# EAGLE design extruder_breakout_14 (EAGLE 6.5.0)
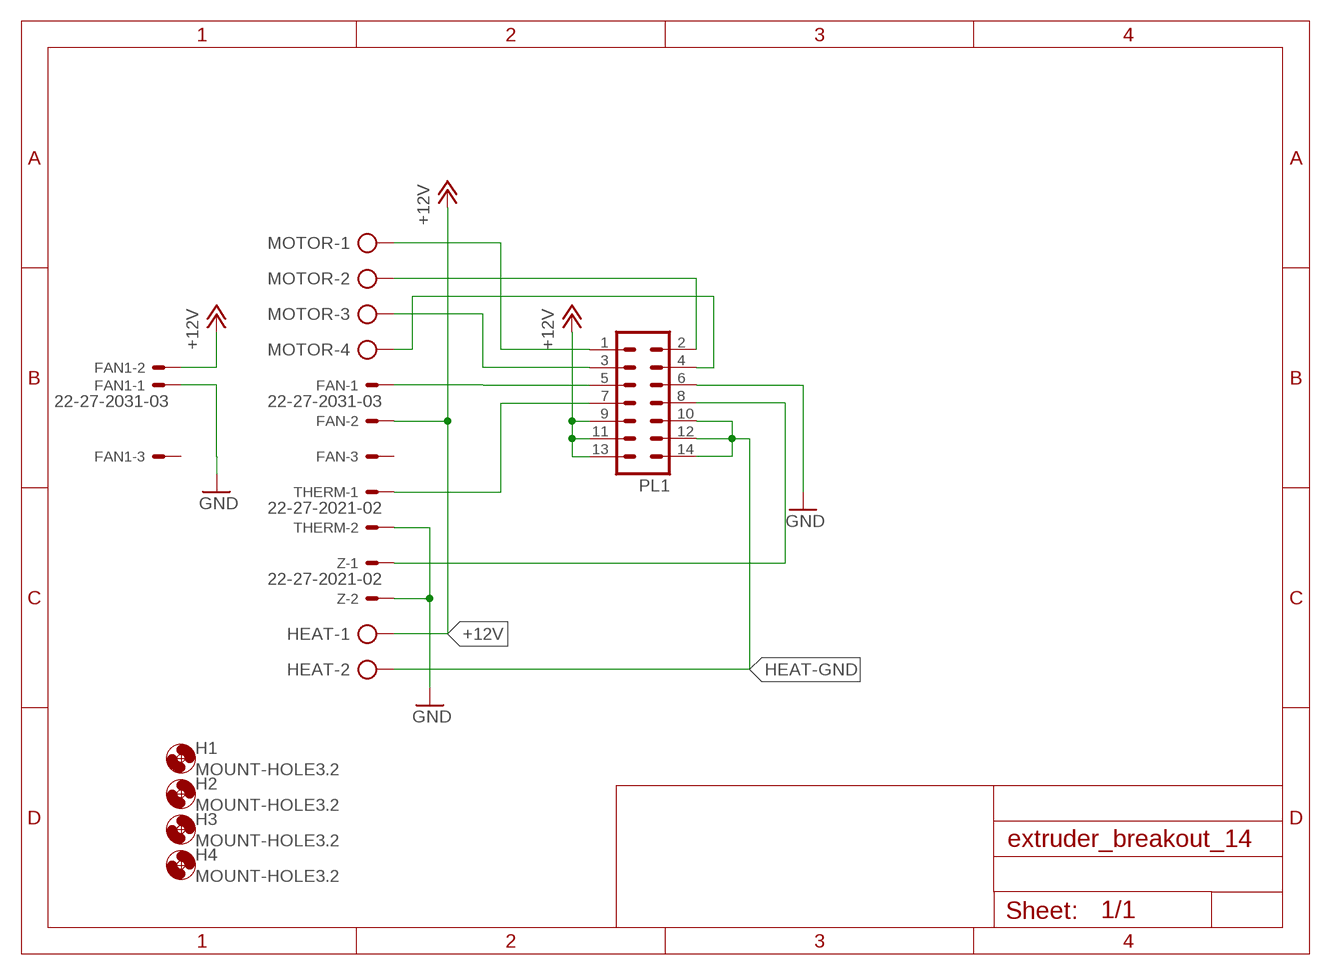
[diagram p0: schematic, sheet 1]

## Parts
FAN  22-27-2031-03  [6410-03]
FAN1  22-27-2031-03  [6410-03]
H1  MOUNT-HOLE3.2  [3,2]
H2  MOUNT-HOLE3.2  [3,2]
H3  MOUNT-HOLE3.2  [3,2]
H4  MOUNT-HOLE3.2  [3,2]
HEAT  AK500/2  [AK500/2]
MOTOR  AK500/4  [AK500/4]
PL1  14V  [14V]
THERM  22-27-2021-02  [6410-02]
Z  22-27-2021-02  [6410-02]

## Nets
+12V: FAN1.2 FAN.2 HEAT.1 PL1.9 PL1.11 PL1.13
GND: FAN1.1 PL1.6 THERM.2 Z.2
HEAT-GND: HEAT.2 PL1.10 PL1.12 PL1.14
N$1: MOTOR.1 PL1.1
N$2: MOTOR.2 PL1.2
N$3: MOTOR.3 PL1.3
N$4: MOTOR.4 PL1.4
N$5: FAN.1 PL1.5
N$6: PL1.7 THERM.1
N$7: PL1.8 Z.1
Unconnected: FAN1.3 FAN.3

## Library data of the parts
FAN FAN1 = con-molex:22-?-03: CONNECTOR wire to board 2.54 mm (.1 inch) pitch header; OC_FARNELL: unknown; OC_NEWARK: unknown
H1-H4 = holes:MOUNT-HOLE: MOUNTING HOLE with drill center marker
HEAT = con-ptr500:AK500/2: CONNECTOR; OC_FARNELL: unknown; OC_NEWARK: unknown
MOTOR = con-ptr500:AK500/4: CONNECTOR; OC_FARNELL: unknown; OC_NEWARK: unknown
PL1 = con-harting-v:14V: CONNECTOR; OC_FARNELL: unknown; OC_NEWARK: unknown
THERM Z = con-molex:22-?-02: CONNECTOR wire to board 2.54 mm (.1 inch) pitch header; OC_FARNELL: unknown; OC_NEWARK: unknown

## Board
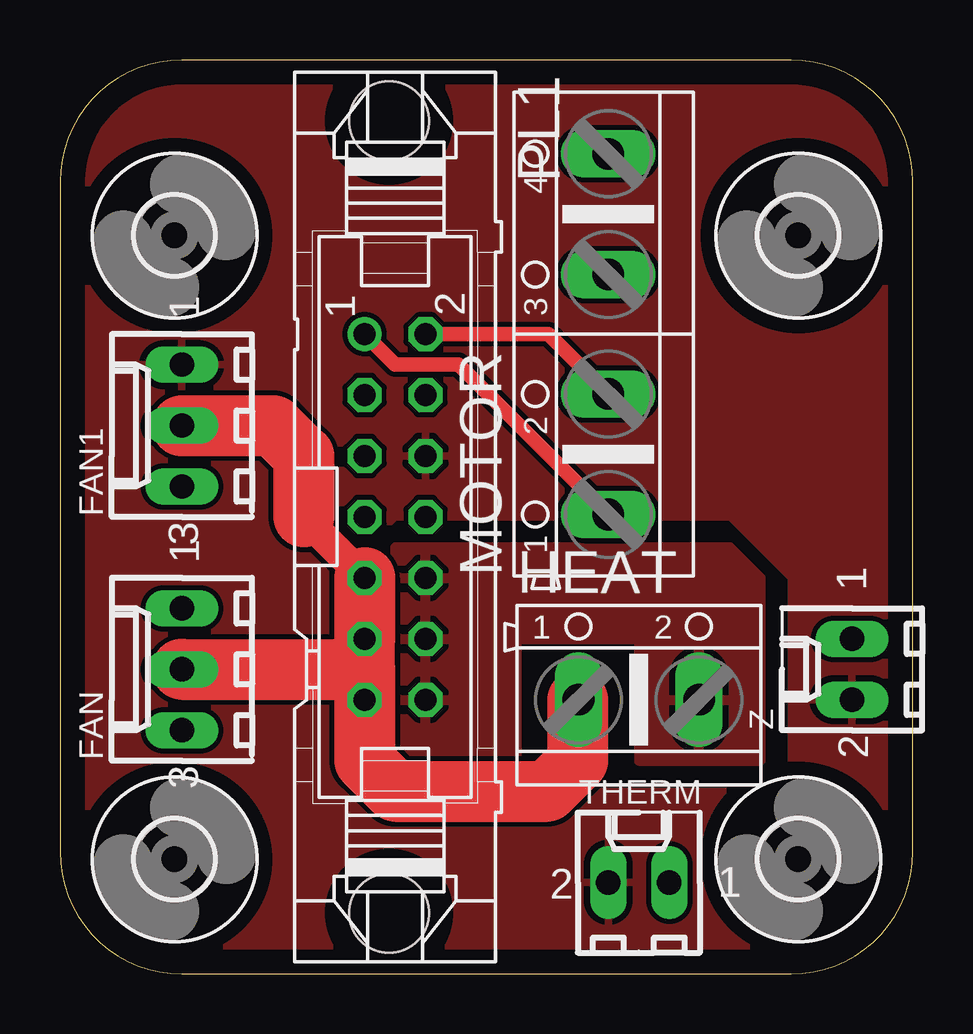
[diagram p1: board, top side]
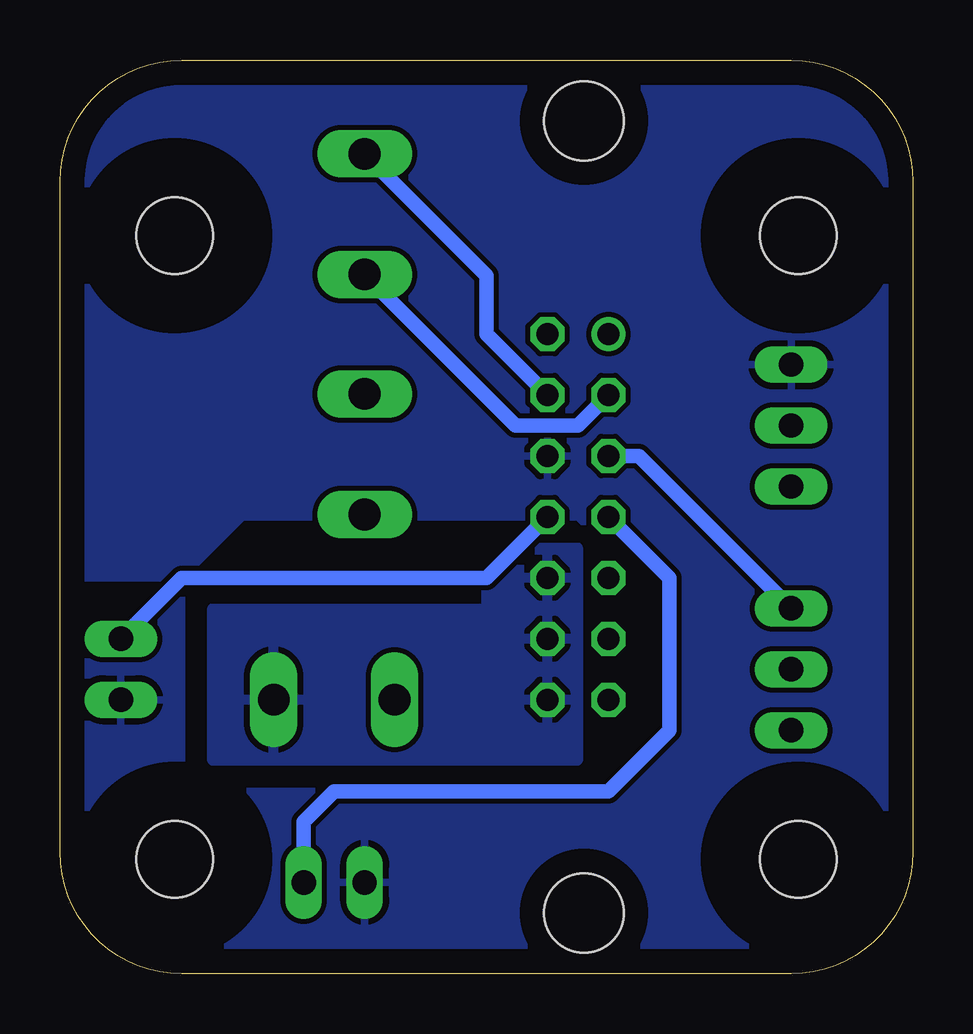
[diagram p2: board, bottom side, seen from below]

Size 35.56 x 38.1 mm. Coordinates in mm from the lower left corner, seen from the top.
Outline: 5.08,0 30.48,0 arc90 35.56,5.08 35.56,30.48 35.56,33.02 arc90 30.48,38.1 5.08,38.1 arc90 0,33.02 0,5.08 arc90 5.08,0
Copper layers (1*16): Top 0.035mm / dielectric 1.5mm / Bottom 0.035mm
Design rules "default": minimum track width 10mil, minimum drill 24mil, track to track 8mil, track to pad 8mil, pad to pad 8mil, via to via 8mil, smd to smd 8mil, copper to edge 40mil, drill to drill 8mil, minimum pad ring 10mil, minimum via ring 8mil, stop-mask expansion 4mil, vias tented up to drill 0mil, thermal gap 10mil

### Footprints (pad centres in the part's own frame; a part is rotated, then mirrored left to right if it is on the bottom)
6410-03 = drill 1.016 long: 1 2.54,0; 2 0,0; 3 -2.54,0
3,2 = hole 3.2: 0,0
AK500/2 = drill 1.321 long: 1 -2.515,0; 2 2.515,0
AK500/4 = drill 1.321 long: 1 -7.518,0; 2 -2.489,0; 3 2.489,0; 4 7.518,0
14V = drill 0.914: 1 -7.62,-1.27 | drill 0.914 octagon: 2 -7.62,1.27; 3 -5.08,-1.27; 4 -5.08,1.27; 5 -2.54,-1.27; 6 -2.54,1.27; 7 0,-1.27; 8 0,1.27; 9 2.54,-1.27; 10 2.54,1.27; 11 5.08,-1.27; 12 5.08,1.27; 13 7.62,-1.27; 14 7.62,1.27 | hole 3.302: 16.51,-0.254; -16.51,-0.254
6410-02 = drill 1.016 long: 1 1.27,0; 2 -1.27,0

### Placement (x,y rotation side)
FAN  5.08,12.7 90 top
FAN1  5.08,22.86 90 top
H1  4.78,4.78 0 top
H2  4.78,30.78 0 top
H3  30.78,30.78 0 top
H4  30.78,4.78 0 top
HEAT  24.13,11.43 0 top
MOTOR  22.86,26.67 90 top
PL1  13.97,19.05 270 top
THERM  24.13,3.81 0 top
Z  33.02,12.7 90 top

### Tracks (layer width: path | path; a pad name or v marks a point on that pad's centre or on a via)
+12V
  Top 1.27: 10.16,19.05 PL1.9 | 21.59,11.41 HEAT.1
  Top 2.54: FAN1.2 8.89,22.86 10.16,21.59 10.16,19.05 | FAN.2 12.7,12.7 | 12.7,12.7 PL1.11 PL1.9 | 12.7,12.7 PL1.13 12.7,8.89 13.97,7.62 20.32,7.62 21.59,8.89 21.59,11.41
GND
  pour Bottom: 30.48,16.51 27.94,19.05 13.97,19.05 12.7,17.78 12.7,7.62 30.48,7.62 30.48,12.7 35.56,12.7 35.56,0 0,0 0,38.1 35.56,38.1 35.56,16.51
  pour Top: 30.48,16.51 27.94,19.05 13.97,19.05 12.7,17.78 12.7,7.62 30.48,7.62 30.48,12.7 35.56,12.7 35.56,0 0,0 0,38.1 35.56,38.1 35.56,16.51
  pour Top: 30.48,17.78 35.56,17.78 35.56,11.43 30.48,11.43
  pour Bottom: 30.48,17.78 35.56,17.78 35.56,11.43 30.48,11.43
HEAT-GND
  pour Top: 13.97,17.78 13.97,8.89 19.05,8.89 19.05,13.97 24.13,13.97 24.13,8.89 29.21,8.89 29.21,16.51 27.94,17.78
  pour Bottom: 13.97,17.78 13.97,8.89 29.21,8.89 29.21,15.24 17.78,15.24 17.78,16.51 16.51,17.78
N$1
  Top 0.61: MOTOR.1 16.61,25.4 13.97,25.4 PL1.1
N$2
  Top 0.61: MOTOR.2 20.37,26.67 PL1.2
N$3
  Bottom 0.61: MOTOR.3 16.56,22.86 16.51,22.86 13.97,22.86 PL1.3
N$4
  Bottom 0.61: MOTOR.4 17.78,29.11 17.78,26.67 PL1.4
N$5
  Bottom 0.61: FAN.1 11.43,21.59 PL1.5
N$6
  Bottom 0.61: THERM.1 25.4,6.35 24.13,7.62 12.7,7.62 10.16,10.16 10.16,16.51 PL1.7
N$7
  Bottom 0.61: Z.1 31.75,15.24 30.48,16.51 17.78,16.51 PL1.8